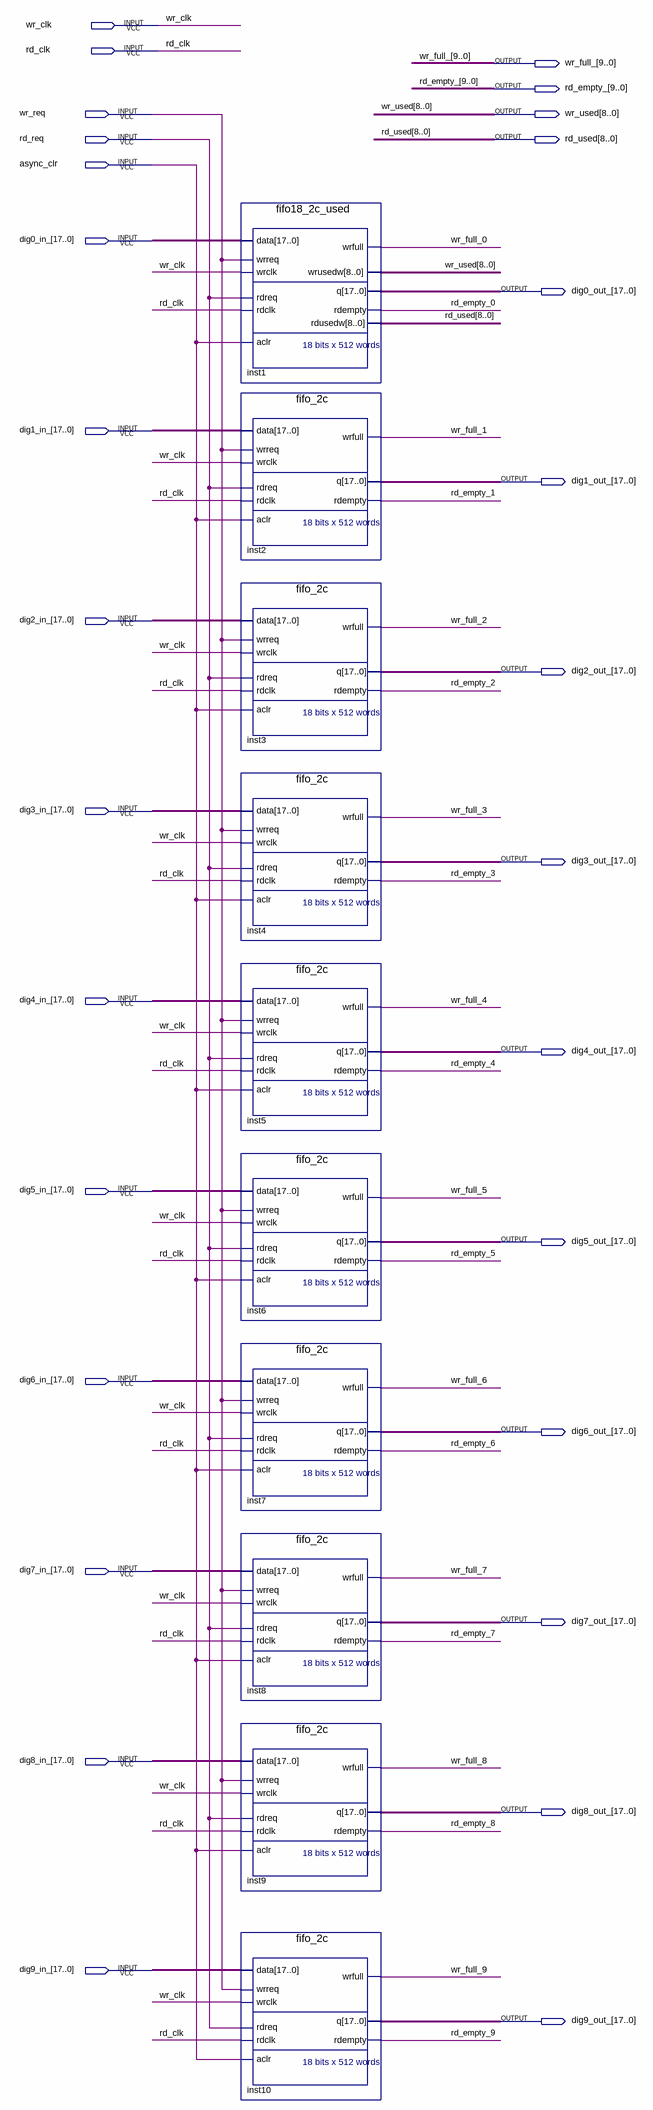
[diagram p0: schematic sheet]
// Quartus schematic fifo_2c_x10.bdf as structural Verilog: 10 symbols, 29 pins
module fifo_2c_x10 (
  input  wr_clk,
  input  rd_clk,
  input  wr_req,
  input  rd_req,
  input  async_clr,
  input  [17:0] dig0_in_,
  input  [17:0] dig1_in_,
  input  [17:0] dig2_in_,
  input  [17:0] dig3_in_,
  input  [17:0] dig4_in_,
  input  [17:0] dig5_in_,
  input  [17:0] dig6_in_,
  input  [17:0] dig7_in_,
  input  [17:0] dig8_in_,
  input  [17:0] dig9_in_,
  output [9:0] wr_full_,
  output [9:0] rd_empty_,
  output [8:0] wr_used,
  output [8:0] rd_used,
  output [17:0] dig0_out_,
  output [17:0] dig1_out_,
  output [17:0] dig2_out_,
  output [17:0] dig3_out_,
  output [17:0] dig4_out_,
  output [17:0] dig5_out_,
  output [17:0] dig6_out_,
  output [17:0] dig7_out_,
  output [17:0] dig8_out_,
  output [17:0] dig9_out_
);

  fifo18_2c_used inst1 (
    .data(dig0_in_), .wrreq(wr_req), .wrclk(wr_clk), .rdreq(rd_req), .rdclk(rd_clk), .aclr(async_clr),
    .wrfull(wr_full_[0]), .wrusedw(wr_used), .q(dig0_out_), .rdempty(rd_empty_[0]), .rdusedw(rd_used));
  fifo_2c inst2 (
    .data(dig1_in_), .wrreq(wr_req), .wrclk(wr_clk), .rdreq(rd_req), .rdclk(rd_clk), .aclr(async_clr),
    .wrfull(wr_full_[1]), .q(dig1_out_), .rdempty(rd_empty_[1]));
  fifo_2c inst3 (
    .data(dig2_in_), .wrreq(wr_req), .wrclk(wr_clk), .rdreq(rd_req), .rdclk(rd_clk), .aclr(async_clr),
    .wrfull(wr_full_[2]), .q(dig2_out_), .rdempty(rd_empty_[2]));
  fifo_2c inst4 (
    .data(dig3_in_), .wrreq(wr_req), .wrclk(wr_clk), .rdreq(rd_req), .rdclk(rd_clk), .aclr(async_clr),
    .wrfull(wr_full_[3]), .q(dig3_out_), .rdempty(rd_empty_[3]));
  fifo_2c inst5 (
    .data(dig4_in_), .wrreq(wr_req), .wrclk(wr_clk), .rdreq(rd_req), .rdclk(rd_clk), .aclr(async_clr),
    .wrfull(wr_full_[4]), .q(dig4_out_), .rdempty(rd_empty_[4]));
  fifo_2c inst6 (
    .data(dig5_in_), .wrreq(wr_req), .wrclk(wr_clk), .rdreq(rd_req), .rdclk(rd_clk), .aclr(async_clr),
    .wrfull(wr_full_[5]), .q(dig5_out_), .rdempty(rd_empty_[5]));
  fifo_2c inst7 (
    .data(dig6_in_), .wrreq(wr_req), .wrclk(wr_clk), .rdreq(rd_req), .rdclk(rd_clk), .aclr(async_clr),
    .wrfull(wr_full_[6]), .q(dig6_out_), .rdempty(rd_empty_[6]));
  fifo_2c inst8 (
    .data(dig7_in_), .wrreq(wr_req), .wrclk(wr_clk), .rdreq(rd_req), .rdclk(rd_clk), .aclr(async_clr),
    .wrfull(wr_full_[7]), .q(dig7_out_), .rdempty(rd_empty_[7]));
  fifo_2c inst9 (
    .data(dig8_in_), .wrreq(wr_req), .wrclk(wr_clk), .rdreq(rd_req), .rdclk(rd_clk), .aclr(async_clr),
    .wrfull(wr_full_[8]), .q(dig8_out_), .rdempty(rd_empty_[8]));
  fifo_2c inst10 (
    .data(dig9_in_), .wrreq(wr_req), .wrclk(wr_clk), .rdreq(rd_req), .rdclk(rd_clk), .aclr(async_clr),
    .wrfull(wr_full_[9]), .q(dig9_out_), .rdempty(rd_empty_[9]));
endmodule
